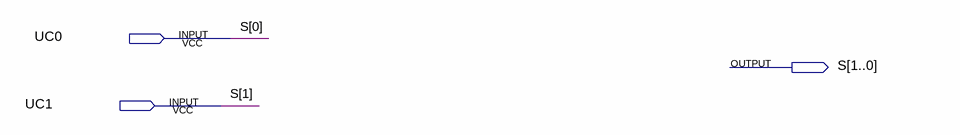
[diagram p0: schematic sheet]
// Quartus schematic UC.bdf as structural Verilog: 0 symbols, 3 pins
module UC (
  input  UC0,
  input  UC1,
  output [1:0] S
);


  assign S = {UC1, UC0};
endmodule
